# EAGLE schematic MSSRP-PRESSURE_GEN_AFE (EAGLE 6.6.0)
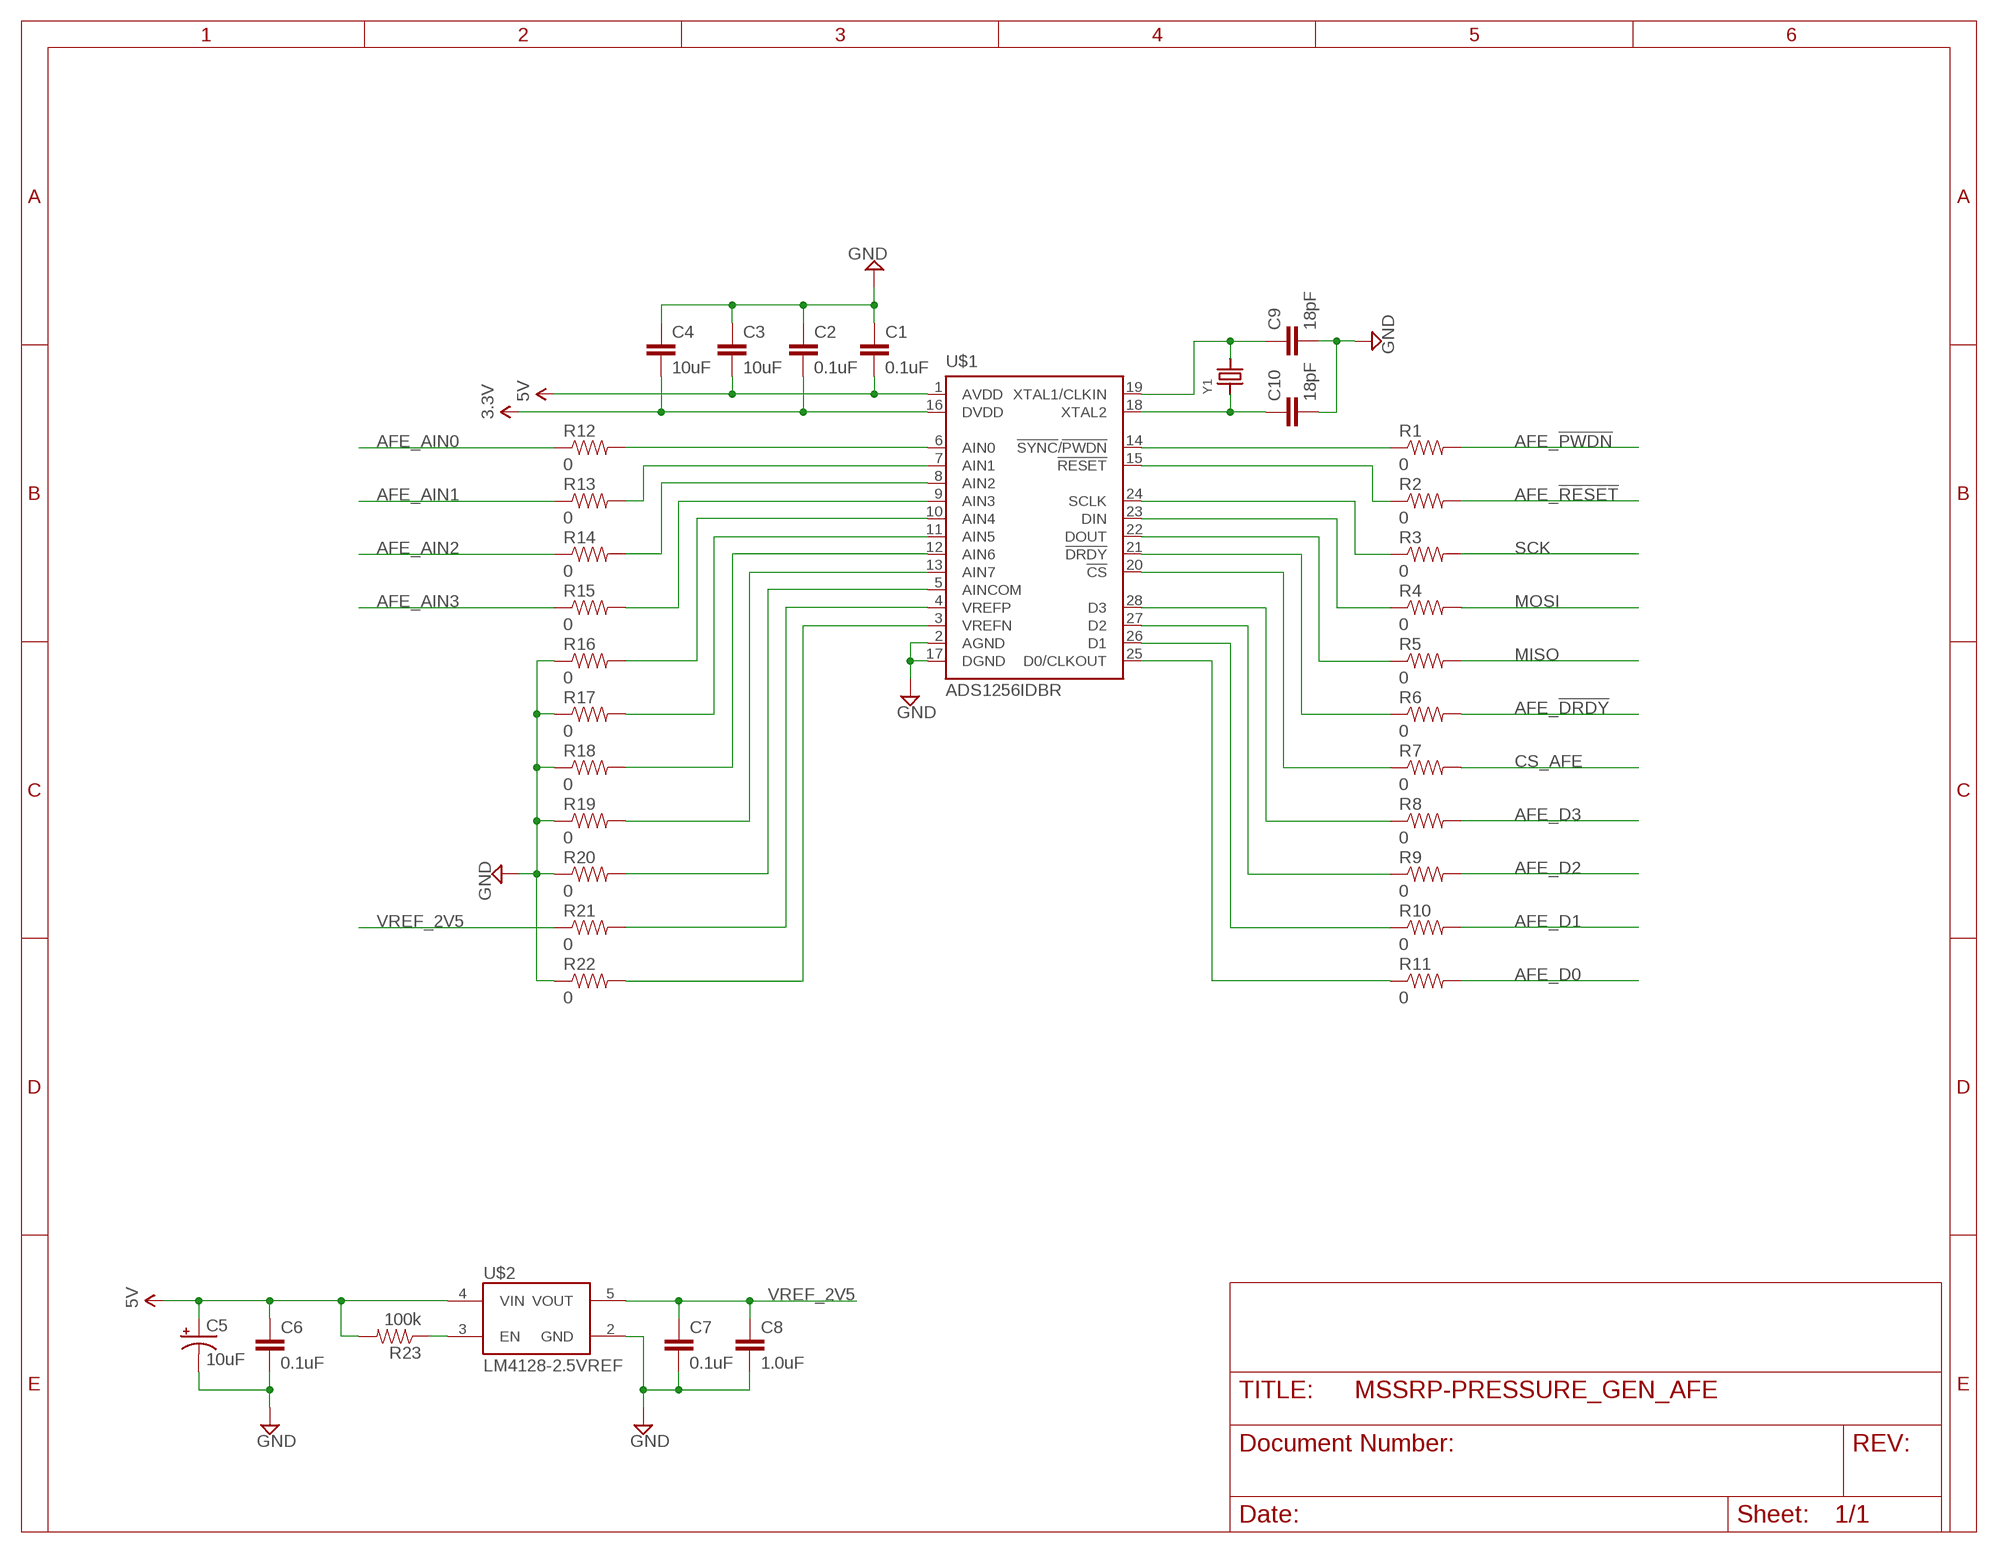
[diagram p0: schematic, sheet 1]

## Parts
C1  0.1uF  0.1UF-25V-5%(0603)  [0603-CAP]
C2  0.1uF  0.1UF-25V-5%(0603)  [0603-CAP]
C3  10uF  10UF-6.3V-20%(0603)  [0603-CAP]
C4  10uF  10UF-6.3V-20%(0603)  [0603-CAP]
C5  10uF  10UF-16V-10%(TANT)  [EIA3216]
C6  0.1uF  0.1UF-25V-5%(0603)  [0603-CAP]
C7  0.1uF  0.1UF-25V-5%(0603)  [0603-CAP]
C8  1.0uF  1.0UF-16V-10%(0603)  [0603-CAP]
C9  18pF  18PF-50V-5%(0603)  [0603-CAP]
C10  18pF  18PF-50V-5%(0603)  [0603-CAP]
R1  0  0OHM1/10W5%(0603)  [0603]
R2  0  0OHM1/10W5%(0603)  [0603]
R3  0  0OHM1/10W5%(0603)  [0603]
R4  0  0OHM1/10W5%(0603)  [0603]
R5  0  0OHM1/10W5%(0603)  [0603]
R6  0  0OHM1/10W5%(0603)  [0603]
R7  0  0OHM1/10W5%(0603)  [0603]
R8  0  0OHM1/10W5%(0603)  [0603]
R9  0  0OHM1/10W5%(0603)  [0603]
R10  0  0OHM1/10W5%(0603)  [0603]
R11  0  0OHM1/10W5%(0603)  [0603]
R12  0  0OHM1/10W5%(0603)  [0603]
R13  0  0OHM1/10W5%(0603)  [0603]
R14  0  0OHM1/10W5%(0603)  [0603]
R15  0  0OHM1/10W5%(0603)  [0603]
R16  0  0OHM1/10W5%(0603)  [0603]
R17  0  0OHM1/10W5%(0603)  [0603]
R18  0  0OHM1/10W5%(0603)  [0603]
R19  0  0OHM1/10W5%(0603)  [0603]
R20  0  0OHM1/10W5%(0603)  [0603]
R21  0  0OHM1/10W5%(0603)  [0603]
R22  0  0OHM1/10W5%(0603)  [0603]
R23  100k  100KOHM1/10W1%(0603)  [0603-RES]
U$1  ADS1256IDBR  [SSOP28]
U$2  LM4128-2.5VREF  [SOT23-5]
Y1  CRYSTALSMD  [HC49UP]

## Nets
3.3V: C2.2 C4.2 U$1.16(DVDD)
5V: C1.2 C3.2 C5.A(+) C6.1 R23.2 U$1.1(AVDD) U$2.4(VIN)
AFE_!DRDY: R6.2
AFE_!PWDN: R1.2
AFE_!RESET: R2.2
AFE_AIN0: R12.1
AFE_AIN1: R13.1
AFE_AIN2: R14.1
AFE_AIN3: R15.1
AFE_D0: R11.2
AFE_D1: R10.2
AFE_D2: R9.2
AFE_D3: R8.2
CS_AFE: R7.2
GND: C1.1 C2.1 C3.1 C4.1 C5.C(-) C6.2 C7.2 C8.2 C9.2 C10.2 R16.1 R17.1 R18.1 R19.1 R20.1 R22.1 U$1.2(AGND) U$1.17(DGND) U$2.2(GND)
MISO: R5.2
MOSI: R4.2
N$1: R12.2 U$1.6(AIN0)
N$2: R13.2 U$1.7(AIN1)
N$3: R14.2 U$1.8(AIN2)
N$4: R15.2 U$1.9(AIN3)
N$5: R1.1 U$1.14(!SYNC!/!PWDN)
N$6: R2.1 U$1.15(!RESET)
N$7: R3.1 U$1.24(SCLK)
N$8: R4.1 U$1.23(DIN)
N$9: R5.1 U$1.22(DOUT)
N$10: R6.1 U$1.21(!DRDY)
N$11: R7.1 U$1.20(!CS)
N$12: R8.1 U$1.28(D3)
N$13: R9.1 U$1.27(D2)
N$14: R10.1 U$1.26(D1)
N$15: R11.1 U$1.25(D0/CLKOUT)
N$16: R16.2 U$1.10(AIN4)
N$17: R17.2 U$1.11(AIN5)
N$18: R18.2 U$1.12(AIN6)
N$19: R19.2 U$1.13(AIN7)
N$20: R20.2 U$1.5(AINCOM)
N$21: R21.2 U$1.4(VREFP)
N$22: R22.2 U$1.3(VREFN)
N$23: R23.1 U$2.3(EN)
N$24: C10.1 U$1.18(XTAL2) Y1.1
N$25: C9.1 U$1.19(XTAL1/CLKIN) Y1.2
SCK: R3.2
VREF_2V5: C7.1 C8.1 R21.1 U$2.5(VOUT)

## Library data of the parts
C1 C2 C6 C7 = SparkFun-Capacitors:0.1UF-25V-5%(0603): CAP-08604; PROD_ID: CAP-08604
C3 C4 = SparkFun-Capacitors:10UF-6.3V-20%(0603): CAP-11015; PROD_ID: CAP-11015
C5 = SparkFun-Capacitors:10UF-16V-10%(TANT): CAP-00811 1206/EIA-3216 Tantalum capacitor; PROD_ID: CAP-00811
C8 = SparkFun-Capacitors:1.0UF-16V-10%(0603): CAP-00868; PROD_ID: CAP-00868
C9 C10 = SparkFun-Capacitors:18PF-50V-5%(0603): CAP-08267; PROD_ID: CAP-08267
R1-R22 = SparkFun-Resistors:0OHM1/10W5%(0603): RES-08609; PROD_ID: RES-08609
R23 = SparkFun-Resistors:100KOHM1/10W1%(0603): RES-07828; PROD_ID: RES-07828
U$1 = MSSRP-Lib:ADS1256
U$2 = SparkFun-PowerIC:LM4128-2.5VREF: .1% accurate low-current voltage reference
Y1 = microbuilder:CRYSTAL: Crystals HC49UP - Surface Mount Crystal 4.0MHz 18pF +/-30ppm Surface Mount Crystal [Digikey: 535-9857-1-ND] 12.0 MHz Surface Mount Crystal [Digikey: 535-9869-6-ND] 25.0 MHz Surface Mount Crystal [Digikey: 535-9078-1-ND] 2.5 x 2.0mm - MEMs SMT Crystal 16.0 MHz 10pF 20ppm 2.5 x 2.0mm Crystal [Digikey -40-85°C: 535-10923-1-ND] 3.2 x 2.5mm - MEMs SMT Crystal 12.0 MHz 8pF 15ppm 3.2 x 2.5mm Crystal [Digikey: -10-70°C: 644-1047-1-ND -40-125°C: 644-1128-1-ND] 16.0 MHz 8pF 15ppm 3.2 x 2.5mm Crystal [Digikey: -10-70°C: 644-1049-1-ND -40-125°C: 644-1129-2-ND] 16.0 MHz 10pF 10ppm 3.2 x 2.5mm Crystal [Digikey: 644-1100-1-ND] 27.12 MHz 18pF 30ppm 3.2 x 2.5mm Crystal [Digikey: 887-1424-1-ND] 27.12MHz 10pF 10ppm 3.2 x 2.5mm Crystal [Digikey: 887-1329-1-ND] 4.9 x 1.8mm - MEMs SMT Crystal 32.768 KHz 12.5pF 20ppm 4.9 x 1.8mm Crystal [Digikey: SE2415CT-ND] 8.0 x 3.8mm - Surface Mount Crystal 32.768kHz 12.5pF 20ppm -40°C-85°C [Digikey: 535-9166-2-ND] Cylinder 32.768KHz Cylinder Crystal (2x6mm body) [Ex. Digikey: 300-8341-2-ND]